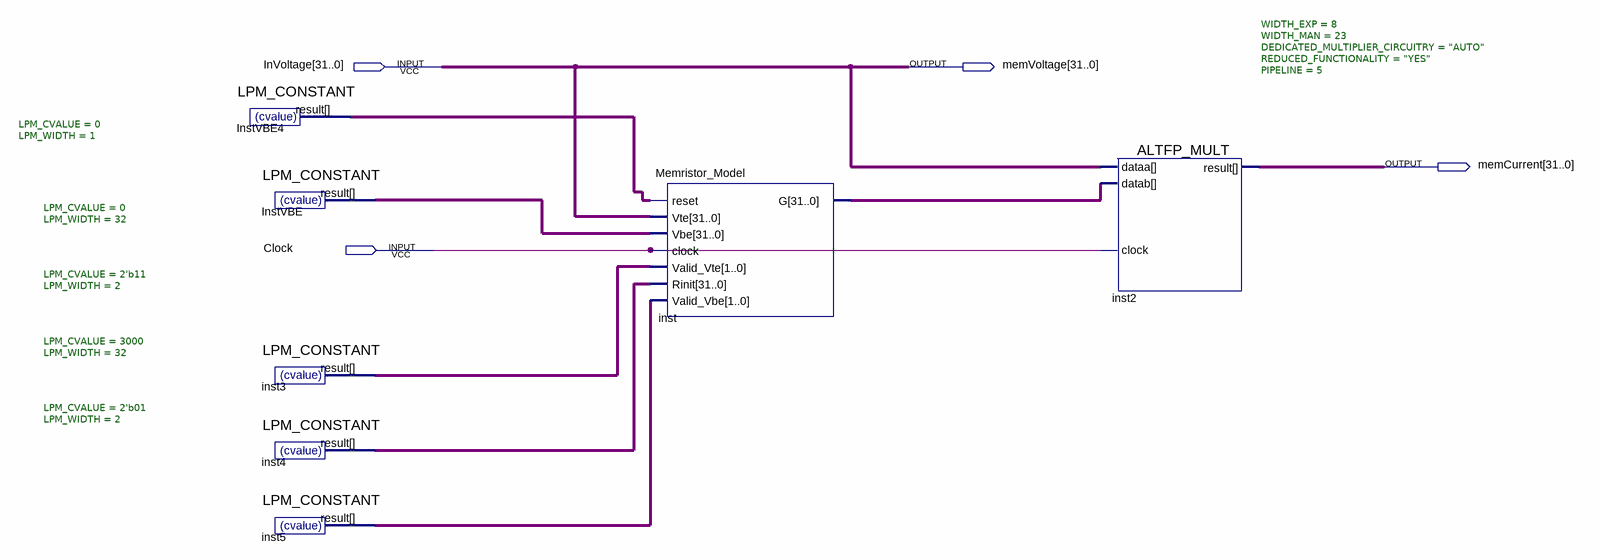
[diagram p0: schematic sheet]
// Quartus schematic HysTest.bdf as structural Verilog: 7 symbols, 4 pins
module HysTest (
  input  [31:0] InVoltage,
  input  Clock,
  output [31:0] memVoltage,
  output [31:0] memCurrent
);

  wire InstVBE4_result;
  wire [1:0] inst3_result, inst5_result;
  wire [31:0] inst4_result, inst_g, InstVBE_result;

  LPM_CONSTANT #(.LPM_CVALUE(0), .LPM_WIDTH(1)) InstVBE4 (.result(InstVBE4_result));
  LPM_CONSTANT #(.LPM_CVALUE(0), .LPM_WIDTH(32)) InstVBE (.result(InstVBE_result));
  LPM_CONSTANT #(.LPM_CVALUE(2'b11), .LPM_WIDTH(2)) inst3 (.result(inst3_result));
  LPM_CONSTANT #(.LPM_CVALUE(3000), .LPM_WIDTH(32)) inst4 (.result(inst4_result));
  LPM_CONSTANT #(.LPM_CVALUE(2'b01), .LPM_WIDTH(2)) inst5 (.result(inst5_result));
  Memristor_Model inst (
    .Rinit(inst4_result), .Valid_Vbe(inst5_result), .Valid_Vte(inst3_result), .Vbe(InstVBE_result),
    .Vte(InVoltage), .clock(Clock), .reset(InstVBE4_result), .G(inst_g));
  ALTFP_MULT #(.WIDTH_EXP(8), .WIDTH_MAN(23), .DEDICATED_MULTIPLIER_CIRCUITRY("AUTO"), .REDUCED_FUNCTIONALITY("YES"), .PIPELINE(5)) inst2 (
    .clock(Clock), .dataa(InVoltage), .datab(inst_g), .result(memCurrent));

  assign memVoltage = InVoltage;
endmodule
